# Altium schematic sheet Keypad.SchDoc
size A
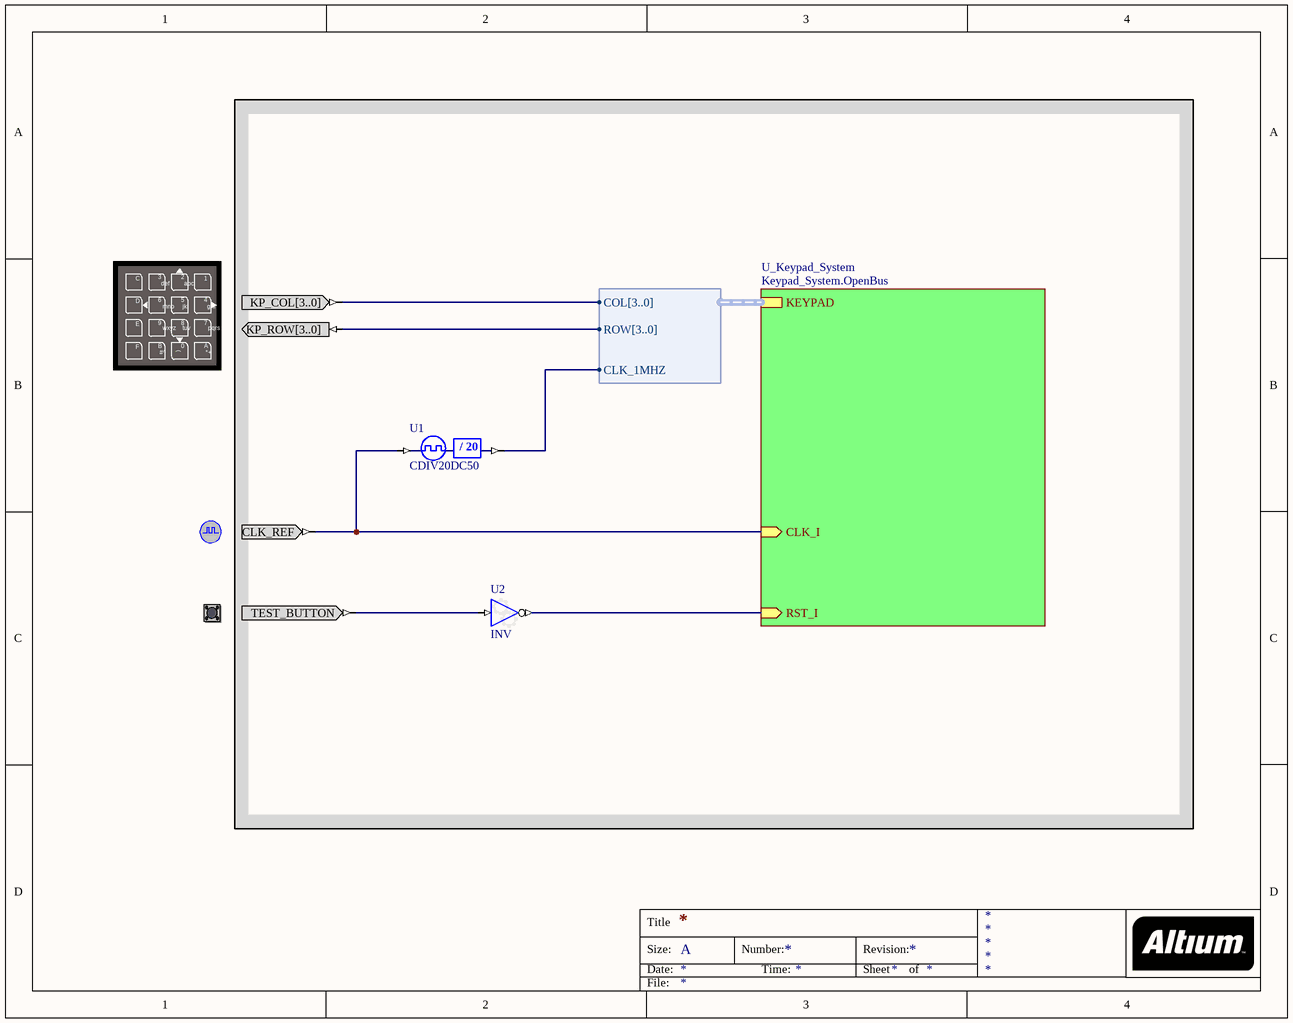
[diagram p0: Keypad.SchDoc]

## Parts
(Parts that share a designator on the sheet are numbered #1, #2 ... from top to bottom, then left to right.)
?#1  KEYPAD  (value not drawn)
?#2  CLOCK_REFERENCE  (value not drawn)
?#3  TEST_BUTTON  (value not drawn)
U1  CDIV20DC50
U2  INV

## Sub-sheets
U_Keypad_System = Keypad_System.OpenBus: KEYPAD (harness KEYPADA_W), RST_I (in), CLK_I (in)

## Harnesses
KEYPADA_W: COL[3..0], ROW[3..0], CLK_1MHZ

## Nets
Net?#1_KP_COL[3..0]: ?#1.KP_COL[3..0] ; sheet U_Keypad_System/KEYPAD.COL[3..0]
Net?#1_KP_ROW[3..0]: ?#1.KP_ROW[3..0] ; sheet U_Keypad_System/KEYPAD.ROW[3..0]
Net?#2_CLK_REF: ?#2.CLK_REF U1.CLKIN ; sheet U_Keypad_System/CLK_I
Net?#3_TEST_BUTTON: ?#3.TEST_BUTTON U2.I
NetU1_CLKDV: U1.CLKDV ; sheet U_Keypad_System/KEYPAD.CLK_1MHZ
NetU2_O: U2.O ; sheet U_Keypad_System/RST_I

## Notes on the sheet
- Title
- Size:
- Date:
- A
- Number:
- Time:
- Revision:
- Sheet
- of
- File:
- (in symbol CDIV20DC50) / 20
- (in symbol KEYPAD) C; 3; 2; 1; def; abc; 6; 5; 4; D; mno; jkl; ghi; E; 9; 8; 7; wxyz; tuv; pqrs; F; B; 0; A; #^; (; *+

## Library data of the parts
?#1 = KEYPAD: Key Pad; PortComponent: True; Published: 19-Nov-2003; Publisher: Altium Limited; HelpURL: TR0102 NanoBoard Technical Reference Manual - NB1.pdf#page=40
?#2 = CLOCK_REFERENCE: Global System Clock Reference Supply; PortComponent: True; Published: 19-Nov-2003; Publisher: Altium Limited; HelpURL: TR0102 NanoBoard Technical Reference Manual - NB1.pdf#page=29
?#3 = TEST_BUTTON: Test Button; PortComponent: True; Published: 19-Nov-2003; Publisher: Altium Limited; HelpURL: TR0102 NanoBoard Technical Reference Manual - NB1.pdf#page=41
U1 = CDIV20DC50: Clock Divider by 20 with 50% Duty Cycle Output; DivisorRate: 20; DutyCycle: 50; ArchiveName: GENERIC; VHDLIB_SIM: GENERIC_LIB; Published: 29-Jan-2004; Publisher: Altium Limited; LastRevisionNo: 1.00.00; HelpURL: CR0118 FPGA Generic Library Guide.pdf#page=143; ComponentLink1URL: CR0127 FPGA Clock Divider Resource Usage.pdf#page=21; ComponentLink1Description: Core &Resource Usage; FunctionalClass: Clock Divider
U2 = INV: Configurable Inverter; ConfigurationParameters: {}Version[1.0]{}SignalCount[1]{}SignalWidth0[1]{}OutputOption0[Inverted]{}EnableMode[None]{}ShowPinNames[False]{}; ConfiguratorName: GENERIC_BUFFER; LastRevisionNo: 1.00.00; Published: 10-Oct-2008; Publisher: Altium Limited